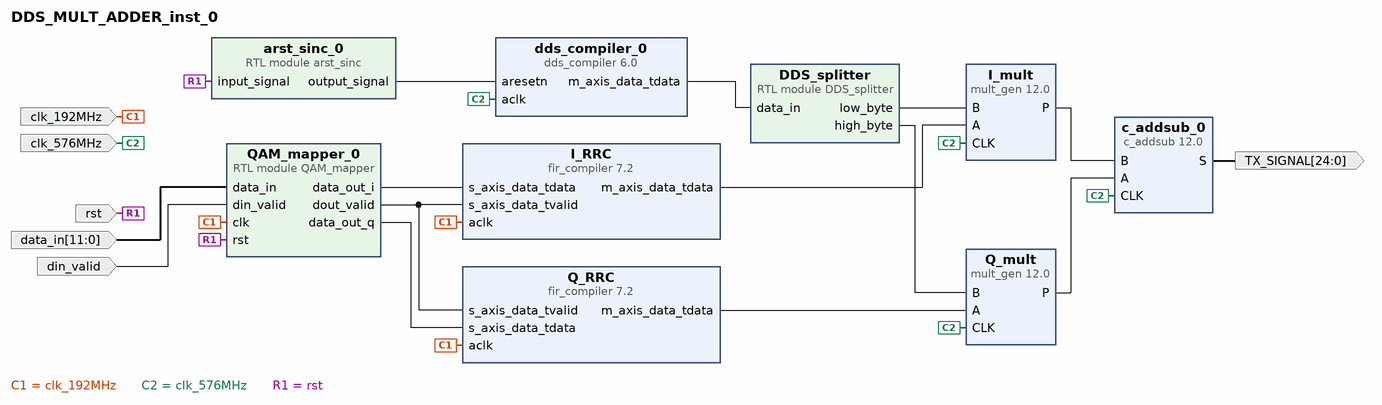
[diagram p0: block diagram of the top level]
# Vivado block design DDS_MULT_ADDER_inst_0, xc7vx485tffg1157-1, Vivado 2021.2
create_bd_design DDS_MULT_ADDER_inst_0

create_bd_port -dir I -type clk clk_192MHz
create_bd_port -dir I -type clk clk_576MHz
create_bd_port -dir I -type rst rst
create_bd_port -dir I -from 11 -to 0 data_in
create_bd_port -dir I din_valid
create_bd_port -dir O -from 24 -to 0 -type data TX_SIGNAL

create_bd_cell -type ip -vlnv xilinx.com:ip:dds_compiler:6.0 dds_compiler_0
set_property -dict [list \
  CONFIG.Channels 1 \
  CONFIG.DATA_Has_TLAST Not_Required \
  CONFIG.DDS_Clock_Rate 576 \
  CONFIG.Frequency_Resolution 0.4 \
  CONFIG.Has_ARESETn true \
  CONFIG.Has_Phase_Out true \
  CONFIG.Latency 4 \
  CONFIG.M_DATA_Has_TUSER Not_Required \
  CONFIG.M_PHASE_Has_TUSER Not_Required \
  CONFIG.Negative_Sine true \
  CONFIG.Noise_Shaping None \
  CONFIG.Output_Frequency1 0 \
  CONFIG.Output_Width 8 \
  CONFIG.PINC1 001011000111000111000111 \
  CONFIG.Parameter_Entry Hardware_Parameters \
  CONFIG.PartsPresent Phase_Generator_and_SIN_COS_LUT \
  CONFIG.Phase_Increment Fixed \
  CONFIG.Phase_Width 24 \
  CONFIG.S_PHASE_Has_TUSER Not_Required \
] [get_bd_cells dds_compiler_0]
create_bd_cell -type ip -vlnv xilinx.com:ip:fir_compiler:7.2 Q_RRC
create_bd_cell -type ip -vlnv xilinx.com:ip:fir_compiler:7.2 I_RRC
create_bd_cell -type module -reference DDS_splitter DDS_splitter
create_bd_cell -type ip -vlnv xilinx.com:ip:mult_gen:12.0 Q_mult
set_property -dict {CONFIG.Multiplier_Construction Use_Mults CONFIG.PortAWidth 16 CONFIG.PortBWidth 8} [get_bd_cells Q_mult]
create_bd_cell -type ip -vlnv xilinx.com:ip:mult_gen:12.0 I_mult
set_property -dict {CONFIG.Multiplier_Construction Use_Mults CONFIG.PortAWidth 16 CONFIG.PortBWidth 8} [get_bd_cells I_mult]
create_bd_cell -type ip -vlnv xilinx.com:ip:c_addsub:12.0 c_addsub_0
set_property -dict [list \
  CONFIG.A_Width 24 \
  CONFIG.B_Value 000000000000000000000000 \
  CONFIG.B_Width 24 \
  CONFIG.CE false \
  CONFIG.Implementation DSP48 \
  CONFIG.Latency 1 \
  CONFIG.Out_Width 25 \
] [get_bd_cells c_addsub_0]
create_bd_cell -type module -reference QAM_mapper QAM_mapper_0
create_bd_cell -type module -reference arst_sinc arst_sinc_0

# ---- connections ----

connect_bd_net [get_bd_pins DDS_splitter/high_byte] [get_bd_pins Q_mult/B]
connect_bd_net [get_bd_pins DDS_splitter/low_byte] [get_bd_pins I_mult/B]
connect_bd_net [get_bd_pins I_RRC/m_axis_data_tdata] [get_bd_pins I_mult/A]
connect_bd_net [get_bd_pins I_mult/P] [get_bd_pins c_addsub_0/B]
connect_bd_net [get_bd_pins QAM_mapper_0/data_out_i] [get_bd_pins I_RRC/s_axis_data_tdata]
connect_bd_net [get_bd_pins QAM_mapper_0/data_out_q] [get_bd_pins Q_RRC/s_axis_data_tdata]
connect_bd_net [get_bd_pins QAM_mapper_0/dout_valid] [get_bd_pins Q_RRC/s_axis_data_tvalid] [get_bd_pins I_RRC/s_axis_data_tvalid]
connect_bd_net [get_bd_pins Q_RRC/m_axis_data_tdata] [get_bd_pins Q_mult/A]
connect_bd_net [get_bd_pins Q_mult/P] [get_bd_pins c_addsub_0/A]
connect_bd_net [get_bd_pins arst_sinc_0/output_signal] [get_bd_pins dds_compiler_0/aresetn]
connect_bd_net [get_bd_pins c_addsub_0/S] [get_bd_ports TX_SIGNAL]
connect_bd_net [get_bd_ports clk_192MHz] [get_bd_pins Q_RRC/aclk] [get_bd_pins I_RRC/aclk] [get_bd_pins QAM_mapper_0/clk]
connect_bd_net [get_bd_ports clk_576MHz] \
  [get_bd_pins dds_compiler_0/aclk] [get_bd_pins I_mult/CLK] [get_bd_pins Q_mult/CLK] [get_bd_pins c_addsub_0/CLK]
connect_bd_net -net data_in_0_1 [get_bd_ports data_in] [get_bd_pins QAM_mapper_0/data_in]
connect_bd_net [get_bd_pins dds_compiler_0/m_axis_data_tdata] [get_bd_pins DDS_splitter/data_in]
connect_bd_net -net din_valid_0_1 [get_bd_ports din_valid] [get_bd_pins QAM_mapper_0/din_valid]
connect_bd_net -net rst_0_1 [get_bd_ports rst] [get_bd_pins QAM_mapper_0/rst] [get_bd_pins arst_sinc_0/input_signal]

validate_bd_design
save_bd_design
